# Altium schematic sheet Top_Level.SchDoc
size A
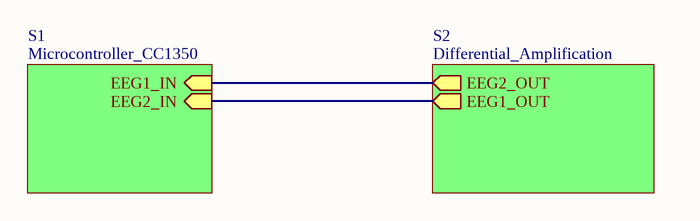
[diagram p0: Top_Level.SchDoc]

## Sub-sheets
S1 = Microcontroller_CC1350: EEG1_IN (in), EEG2_IN (in)
S2 = Differential_Amplification: EEG2_OUT (out), EEG1_OUT (out)

## Nets
(unnamed): sheet S1/EEG1_IN, sheet S2/EEG2_OUT
(unnamed): sheet S1/EEG2_IN, sheet S2/EEG1_OUT